# EAGLE schematic CopernicusBasicTestCircuit (EAGLE 6.4)
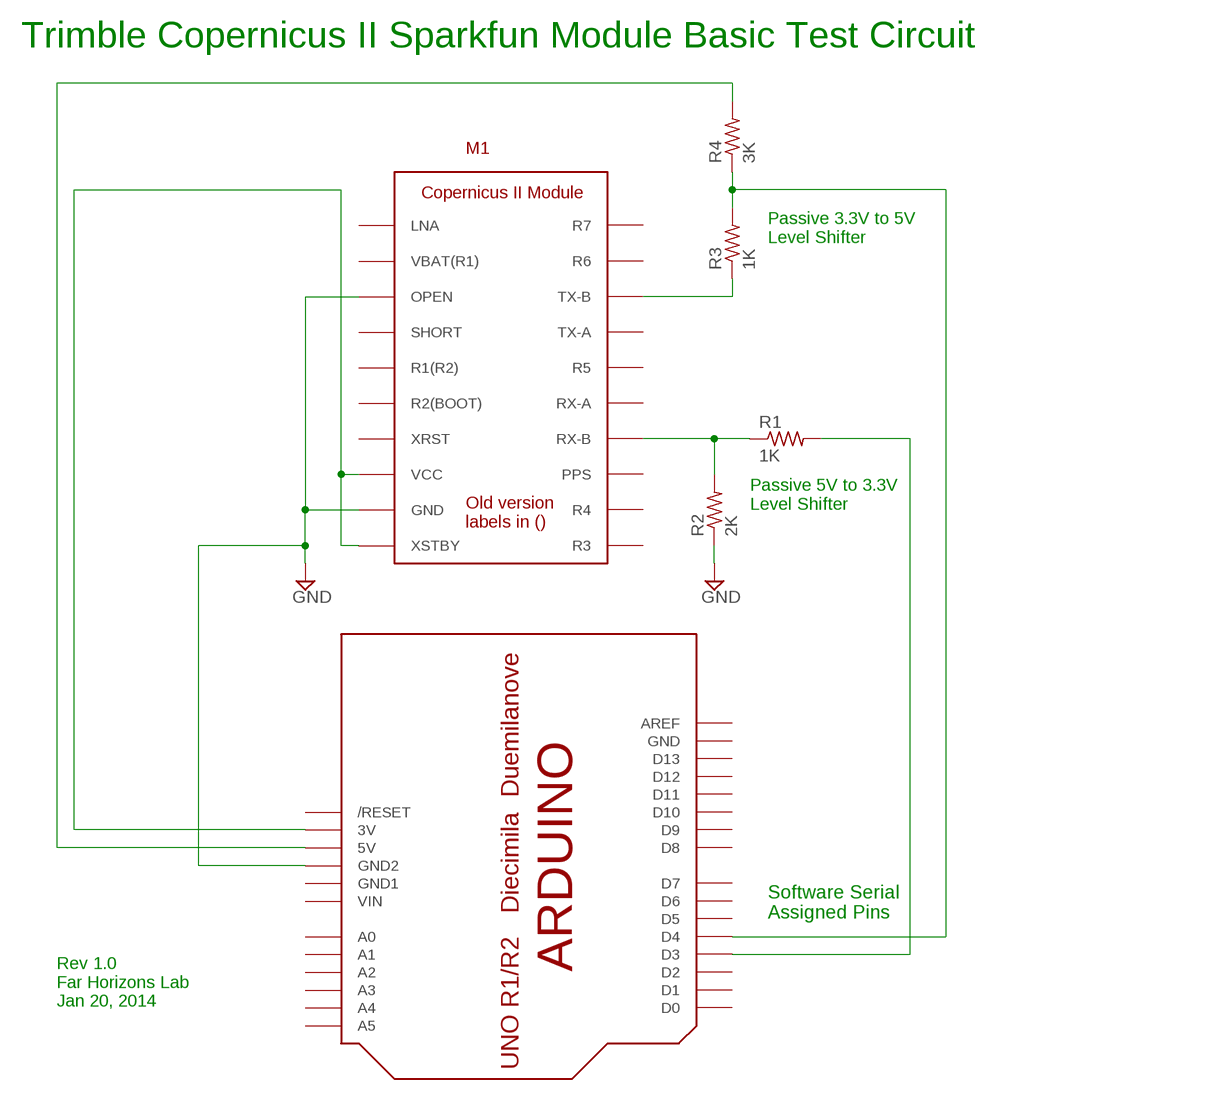
[diagram p0: schematic, sheet 1]

## Parts
M1  COPERNICUS_II_MODULE  [COPERNICUS_II_MODULE]
R1  1K  R-US_0207/10  [0207/10]
R2  2K  R-US_0207/10  [0207/10]
R3  1K  R-US_0207/10  [0207/10]
R4  3K  R-US_0207/10  [0207/10]
U$1  ARDUINOUNO  [ARDUINO]

## Nets
GND: M1.P$3(OPEN) M1.P$9(GND) R2.1 U$1.GND2
N$1: M1.P$8(VCC) M1.P$10(XSTBY) U$1.3V
N$2: R3.2 R4.1 U$1.D4
N$3: M1.P$18(TX-B) R3.1
N$4: R1.2 U$1.D3
N$6: M1.P$14(RX-B) R1.1 R2.2
N$7: R4.2 U$1.5V
Unconnected: M1.P$1(LNA) M1.P$2(VBAT(R1)) M1.P$4(SHORT) M1.P$5(R1(R2)) M1.P$6(R2(BOOT)) M1.P$7(XRST) M1.P$11(R3) M1.P$12(R4) M1.P$13(PPS) M1.P$15(RX-A) M1.P$16(R5) M1.P$17(TX-A) M1.P$19(R6) M1.P$20(R7) U$1.A0 U$1.A1 U$1.A2 U$1.A3 U$1.A4 U$1.A5 U$1.AREF U$1.D0 U$1.D1 U$1.D2 U$1.D5 U$1.D6 U$1.D7 U$1.D8 U$1.D9 U$1.D10 U$1.D11 U$1.D12 U$1.D13 U$1.GND U$1.GND1 U$1.RESET(/RESET) U$1.VIN

## Notes on the sheet
- Trimble Copernicus II Sparkfun Module Basic Test Circuit
- Passive 3.3V to 5V
  Level Shifter
- Passive 5V to 3.3V
  Level Shifter
- Software Serial
  Assigned Pins
- Rev 1.0
  Far Horizons Lab
  Jan 20, 2014

## Library data of the parts
M1 = fhdevices:COPERNICUS_II_MODULE
R1-R4 = resistor:R-US_: RESISTOR, American symbol
U$1 = adafruit-fh:ARDUINO: Arduino Diecimila/Duemilanove Make a shield with ease, this package has all the named pins as well as the two mounting drill holes and an outline of the USB and DC power connector. The outline is on the DIMENSION layer, so if your board house uses it they will cut the outline to match. http://www.ladyada.net/library/pcb/eaglelibrary.html